# Altium schematic sheet 1V8_SUPPLY.SchDoc: My title
size A3; Organization: University of California; Address1: 475 Portola Plaza; Address2: Los Angeles, CA 90095; Revision: R01; SheetNumber: 1; SheetTotal: 1
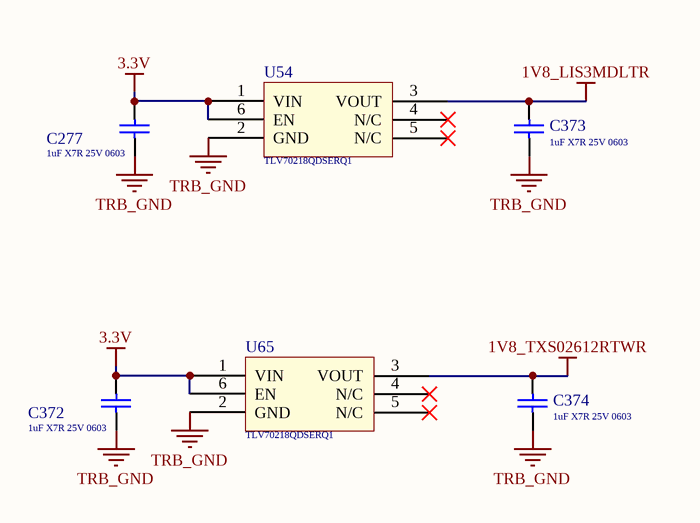
[diagram p0: 1V8_SUPPLY.SchDoc]

## Parts
C277  Capacitance: 1uF X7R 25V 0603  [Cap_Murata_GCJ188R71E105KA01J_1uF]  (hidden comment: Cap_Murata_GCJ188R71E105KA01J_1uF)
C372  Capacitance: 1uF X7R 25V 0603  [Cap_Murata_GCJ188R71E105KA01J_1uF]  (hidden comment: Cap_Murata_GCJ188R71E105KA01J_1uF)
C373  Capacitance: 1uF X7R 25V 0603  [Cap_Murata_GCJ188R71E105KA01J_1uF]  (hidden comment: Cap_Murata_GCJ188R71E105KA01J_1uF)
C374  Capacitance: 1uF X7R 25V 0603  [Cap_Murata_GCJ188R71E105KA01J_1uF]  (hidden comment: Cap_Murata_GCJ188R71E105KA01J_1uF)
U54  Series: TLV70218QDSERQ1  [LDO_Texas_Instruments_TLV70218QDSERQ1_300mA]  (hidden comment: LDO_Texas_Instruments_TLV70218QDSERQ1_300mA)
U65  Series: TLV70218QDSERQ1  [LDO_Texas_Instruments_TLV70218QDSERQ1_300mA]  (hidden comment: LDO_Texas_Instruments_TLV70218QDSERQ1_300mA)

## Nets
1V8_LIS3MDLTR: C373.2 U54.3(VOUT)
1V8_TXS02612RTWR: C374.2 U65.3(VOUT)
3.3V: C277.2 C372.2 U54.1(VIN) U54.6(EN) U65.1(VIN) U65.6(EN)
TRB_GND: C277.1 C372.1 C373.1 C374.1 U54.2(GND) U65.2(GND)

Not connected (* = marked no-connect by the designer): U54 4(N/C)* 5(N/C)*; U65 4(N/C)* 5(N/C)*

## Notes on the sheet
- 475 Portola Plaza
- GAPS TOF
- igarcia91@g.ucla.edu
- Los Angeles, CA
- 310-825-0344
- Size:
- Date:
- Letter
- Number:
- Time:
- Sheet
- Revision:
- of
- andrew.peck@cern.ch
- spq@ucla.edu
- File:

## Library data of the parts
C277 C372-C374 = Cap_Murata_GCJ188R71E105KA01J_1uF: CAP CER 1uF 25V X7R 0603; Supplier 1: Mouser; Supplier Part Number 1: 81-GCJ188R71E105KA1J
U54 U65 = LDO_Texas_Instruments_TLV70218QDSERQ1_300mA: LDO Voltage Regulators 300mA Low; Supplier 1: Mouser; Supplier Part Number 1: 595-TLV70218QDSERQ1